# Altium schematic sheet Drive-It_schem.SchDoc
size 431 x 279 mm; SheetNumber: 1; SheetTotal: 1
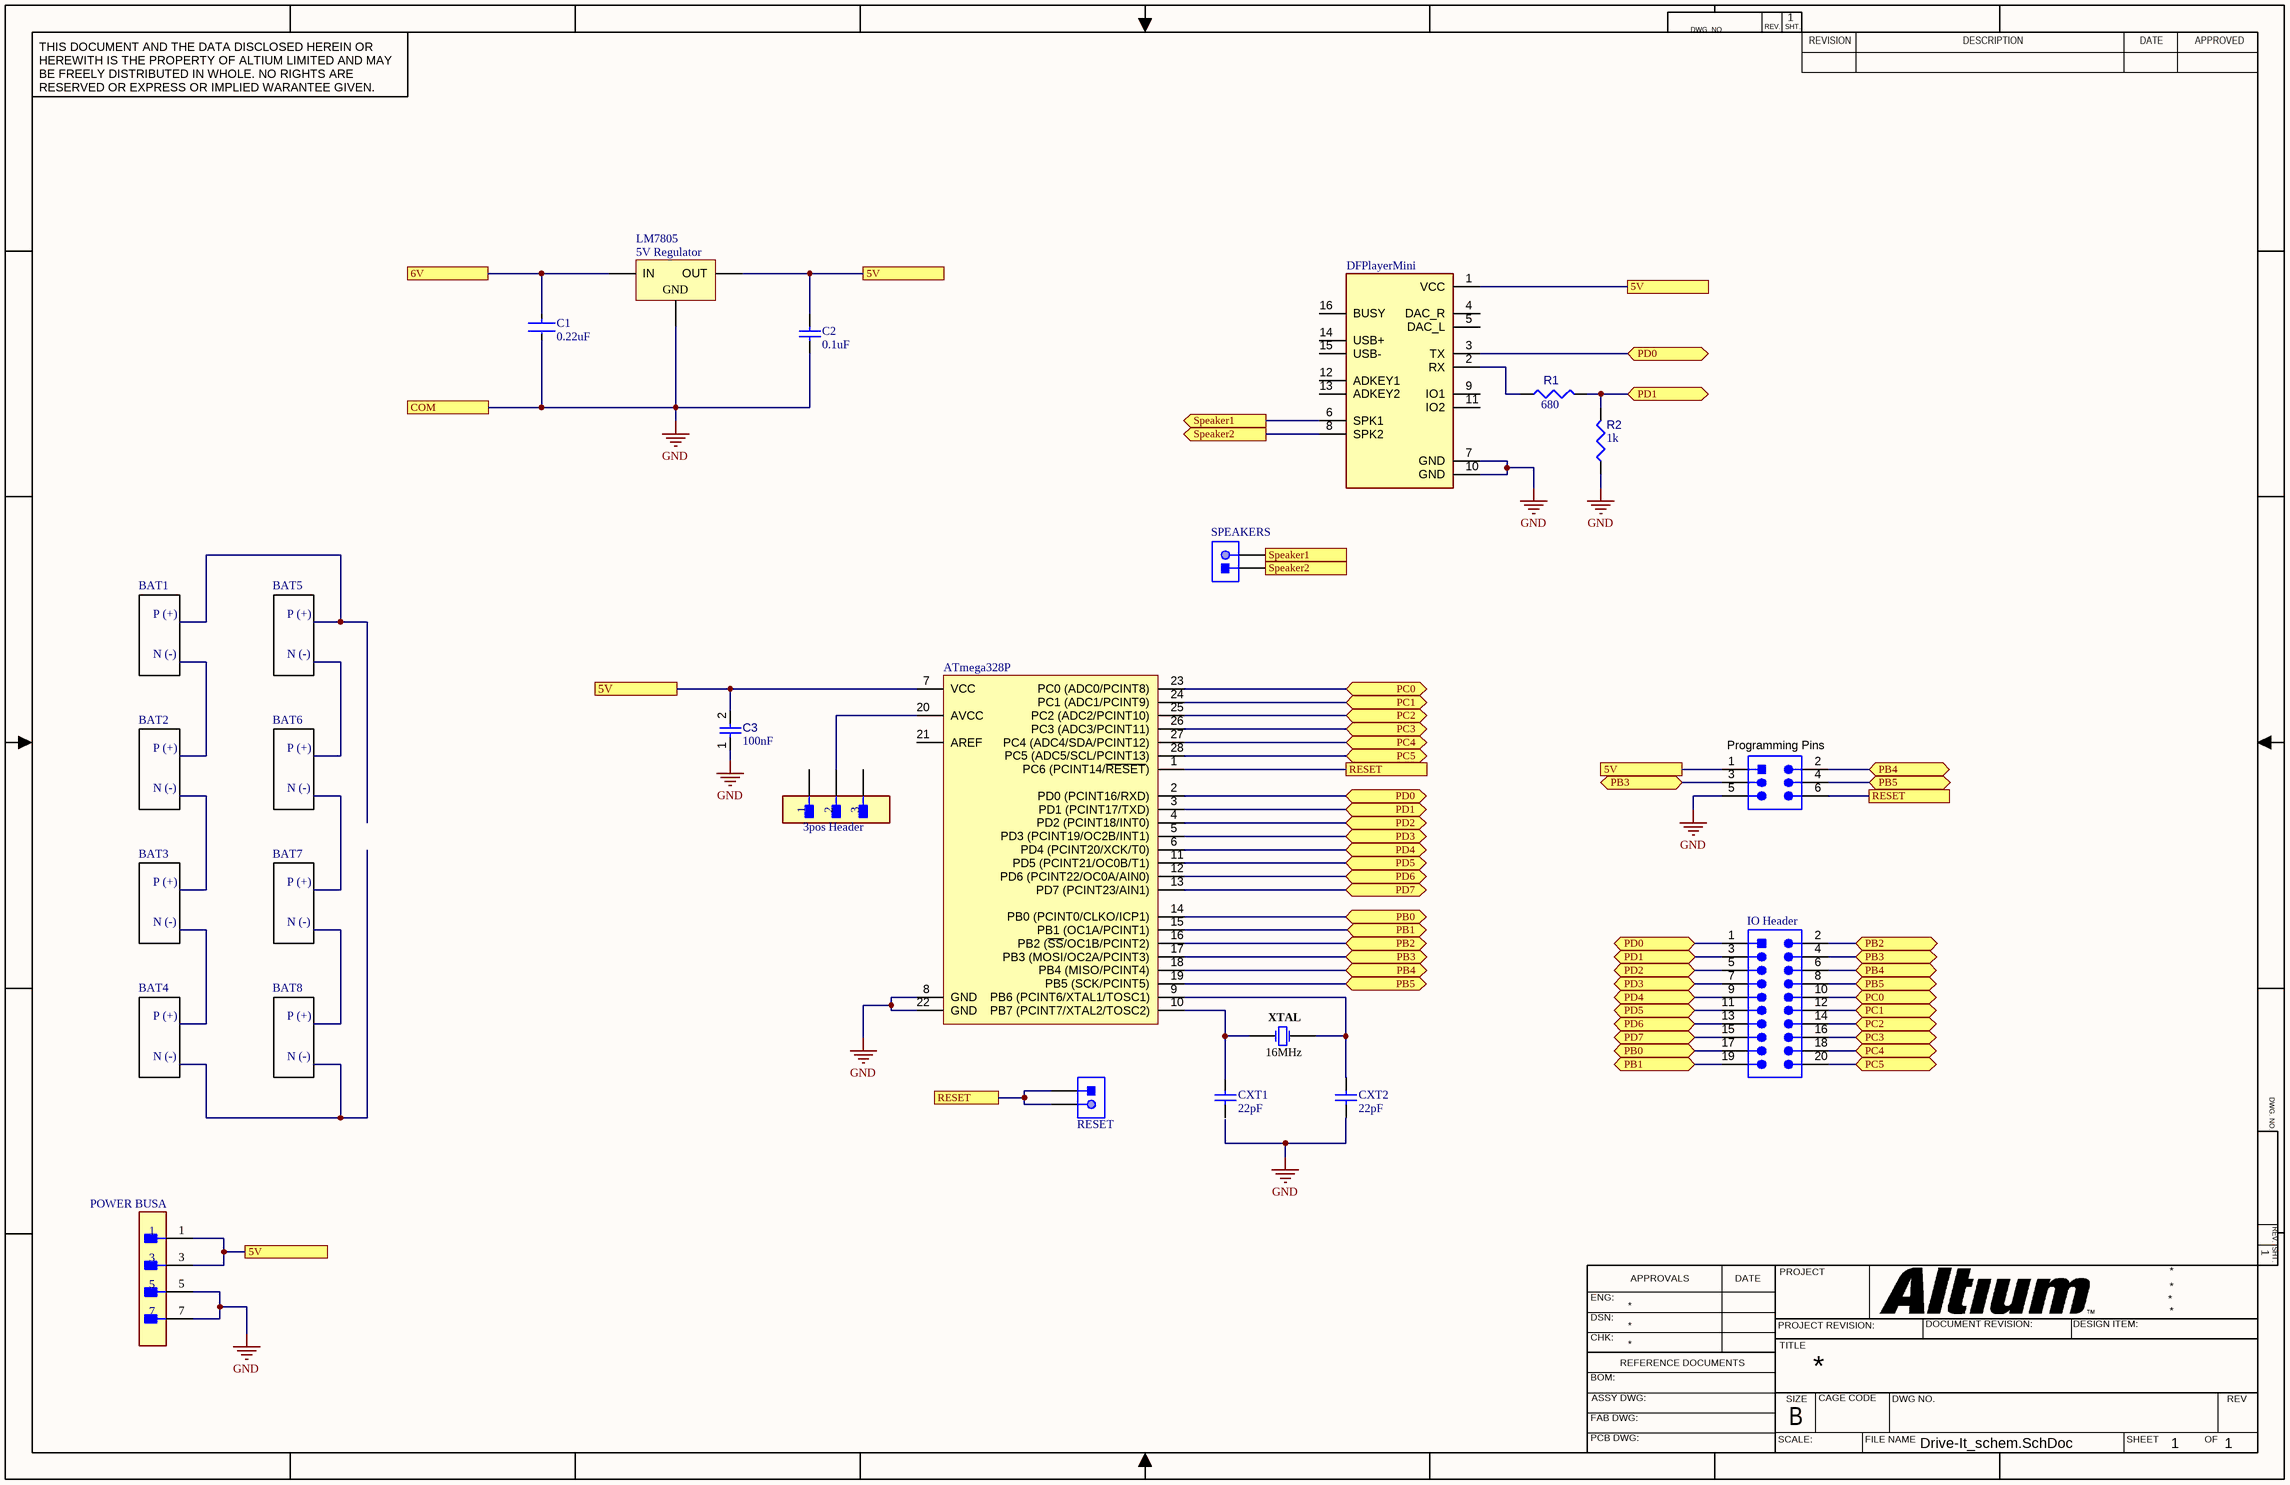
[diagram p0: Drive-It_schem.SchDoc]

## Parts
3pos_Header  (no value)  [FP-NRPN031PAEN-RC-MFG]
5V_Regulator  LM7805  [FAIR-TO-220-3]
ATmega328P  (no value)  [ATML-28P3]
BAT1  (no value)  [BAT_2222]
BAT2  (no value)  [BAT_2222]
BAT3  (no value)  [BAT_2222]
BAT4  (no value)  [BAT_2222]
BAT5  (no value)  [BAT_2222]
BAT6  (no value)  [BAT_2222]
BAT7  (no value)  [BAT_2222]
BAT8  (no value)  [BAT_2222]
C1  0.22uF  [FP-RCE1K1-2_5-MFG]
C2  0.1uF  [VISH-K104K15X7RF5TL2]
C3  value 100nF  [CAPR51-254-508X318X736]  (hidden comment: C320C104K5R5TA)
CXT1  22pF  [KEMT-C315-THT-2]
CXT2  22pF  [KEMT-C315-THT-2]
DFPlayerMini  (no value)  [MODULE_DFR0299]
IO_Header  (no value)  [SMTC-MW-10-03-G-D-245-065-P_V]
POWER_BUS  POWER BUS  [FP-M20-9980446-MFG]  (value not drawn)  (part A of 2)
Programming_Pins  (no value)  [SMTC-TSW-103-07-G-D_V]
R1  value 680  [RESA60-630X240]  (hidden comment: MFR-25FBF52-1K)
R2  value 1k  [RESA60-630X240]  (hidden comment: MFR-25FBF52-1K)
RESET  (no value)  [JST-B2P-VH(LF)(SN)_V]
SPEAKERS  (no value)  [JST-B2P-VH(LF)(SN)_V]
XTAL  16MHz  [JPY-49S-18PF]

## Ports
5V (see Drive-It_schem[3C], Drive-It_schem[3E], Drive-It_schem[5E], Drive-It_schem[6D]), 5V (see Drive-It_schem[3C], Drive-It_schem[3E], Drive-It_schem[5E], Drive-It_schem[8A]), 5V (see Drive-It_schem[3C], Drive-It_schem[3E], Drive-It_schem[6D], Drive-It_schem[8A]), 5V (see Drive-It_schem[3C], Drive-It_schem[5E], Drive-It_schem[6D], Drive-It_schem[8A]), 5V (see Drive-It_schem[3E], Drive-It_schem[5E], Drive-It_schem[6D], Drive-It_schem[8A]), 6V, COM, PB0 (bidir, see Drive-It_schem[3B]), PB0 (bidir, see Drive-It_schem[4C]), PB1 (bidir, see Drive-It_schem[3B]), PB1 (bidir, see Drive-It_schem[4C]), PB2 (bidir, see Drive-It_schem[2C]), PB2 (bidir, see Drive-It_schem[4C]), PB3 (bidir, see Drive-It_schem[2C], Drive-It_schem[3C]), PB3 (bidir, see Drive-It_schem[2C], Drive-It_schem[4C]), PB3 (bidir, see Drive-It_schem[3C], Drive-It_schem[4C]), PB4 (bidir, see Drive-It_schem[2C]), PB4 (bidir, see Drive-It_schem[2C], Drive-It_schem[4C]), PB5 (bidir, see Drive-It_schem[2C]), PB5 (bidir, see Drive-It_schem[2C], Drive-It_schem[4C]), PC0 (bidir, see Drive-It_schem[2B]), PC0 (bidir, see Drive-It_schem[4D]), PC1 (bidir, see Drive-It_schem[2B]), PC1 (bidir, see Drive-It_schem[4D]), PC2 (bidir, see Drive-It_schem[2B]), PC2 (bidir, see Drive-It_schem[4D]), PC3 (bidir, see Drive-It_schem[2B]), PC3 (bidir, see Drive-It_schem[4D]), PC4 (bidir, see Drive-It_schem[2B]), PC4 (bidir, see Drive-It_schem[4D]), PC5 (bidir, see Drive-It_schem[2B]), PC5 (bidir, see Drive-It_schem[4C]), PD0 (bidir, see Drive-It_schem[3C], Drive-It_schem[3E]), PD0 (bidir, see Drive-It_schem[3C], Drive-It_schem[4C]), PD0 (bidir, see Drive-It_schem[3E], Drive-It_schem[4C]), PD1 (bidir, see Drive-It_schem[3C], Drive-It_schem[3E]), PD1 (bidir, see Drive-It_schem[3C], Drive-It_schem[4C]), PD1 (bidir, see Drive-It_schem[3E], Drive-It_schem[4C]), PD2 (bidir, see Drive-It_schem[3C]), PD2 (bidir, see Drive-It_schem[4C]), PD3 (bidir, see Drive-It_schem[3C]), PD3 (bidir, see Drive-It_schem[4C]), PD4 (bidir, see Drive-It_schem[3B]), PD4 (bidir, see Drive-It_schem[4C]), PD5 (bidir, see Drive-It_schem[3B]), PD5 (bidir, see Drive-It_schem[4C]), PD6 (bidir, see Drive-It_schem[3B]), PD6 (bidir, see Drive-It_schem[4C]), PD7 (bidir, see Drive-It_schem[3B]), PD7 (bidir, see Drive-It_schem[4C]), RESET (see Drive-It_schem[2C], Drive-It_schem[4C]), RESET (see Drive-It_schem[2C], Drive-It_schem[5B]), RESET (see Drive-It_schem[4C], Drive-It_schem[5B]), Speaker1 (in, see Drive-It_schem[4E]), Speaker1 (out, see Drive-It_schem[4D]), Speaker2 (in, see Drive-It_schem[4E]), Speaker2 (out, see Drive-It_schem[4D])

## Nets
GND: 5V_Regulator.2(GND) ATmega328P.8(GND) ATmega328P.22(GND) C1.2 C2.1 C3.1 CXT2.1 DFPlayerMini.7(GND) DFPlayerMini.10(GND) POWER_BUS.5 POWER_BUS.7 Programming_Pins.5 R2.1 ; port COM
5V: 5V_Regulator.3(OUT) ATmega328P.7(VCC) C2.2 C3.2 DFPlayerMini.1(VCC) POWER_BUS.1 POWER_BUS.3 Programming_Pins.1 ; port 5V
6V: 5V_Regulator.1(IN) C1.1 ; port 6V
PB0: ATmega328P.14(PB0_(PCINT0/CLKO/ICP1)) IO_Header.17 ; port PB0
PB1: ATmega328P.15(PB1_(OC1A/PCINT1)) IO_Header.19 ; port PB1
PB2: ATmega328P.16(PB2_(~{SS}/OC1B/PCINT2)) IO_Header.2 ; port PB2
PB3: ATmega328P.17(PB3_(MOSI/OC2A/PCINT3)) IO_Header.4 Programming_Pins.3 ; port PB3
PB4: ATmega328P.18(PB4_(MISO/PCINT4)) IO_Header.6 Programming_Pins.2 ; port PB4
PB5: ATmega328P.19(PB5_(SCK/PCINT5)) IO_Header.8 Programming_Pins.4 ; port PB5
PC0: ATmega328P.23(PC0_(ADC0/PCINT8)) IO_Header.10 ; port PC0
PC1: ATmega328P.24(PC1_(ADC1/PCINT9)) IO_Header.12 ; port PC1
PC2: ATmega328P.25(PC2_(ADC2/PCINT10)) IO_Header.14 ; port PC2
PC3: ATmega328P.26(PC3_(ADC3/PCINT11)) IO_Header.16 ; port PC3
PC4: ATmega328P.27(PC4_(ADC4/SDA/PCINT12)) IO_Header.18 ; port PC4
PC5: ATmega328P.28(PC5_(ADC5/SCL/PCINT13)) IO_Header.20 ; port PC5
PD0: ATmega328P.2(PD0_(PCINT16/RXD)) DFPlayerMini.3(TX) IO_Header.1 ; port PD0
PD1: ATmega328P.3(PD1_(PCINT17/TXD)) IO_Header.3 R1.2 R2.2 ; port PD1
PD2: ATmega328P.4(PD2_(PCINT18/INT0)) IO_Header.5 ; port PD2
PD3: ATmega328P.5(PD3_(PCINT19/OC2B/INT1)) IO_Header.7 ; port PD3
PD4: ATmega328P.6(PD4_(PCINT20/XCK/T0)) IO_Header.9 ; port PD4
PD5: ATmega328P.11(PD5_(PCINT21/OC0B/T1)) IO_Header.11 ; port PD5
PD6: ATmega328P.12(PD6_(PCINT22/OC0A/AIN0)) IO_Header.13 ; port PD6
PD7: ATmega328P.13(PD7_(PCINT23/AIN1)) IO_Header.15 ; port PD7
RESET: ATmega328P.1(PC6_(PCINT14/~{RESET})) Programming_Pins.6 RESET.1 RESET.2 ; port RESET
Speaker1: DFPlayerMini.6(SPK1) SPEAKERS.2 ; port Speaker1
Speaker2: DFPlayerMini.8(SPK2) SPEAKERS.1 ; port Speaker2
Net3pos_Header_2: 3pos_Header.2 ATmega328P.20(AVCC)
NetATmega328P_9: ATmega328P.9(PB6_(PCINT6/XTAL1/TOSC1)) CXT2.2 XTAL.1
NetATmega328P_10: ATmega328P.10(PB7_(PCINT7/XTAL2/TOSC2)) CXT1.2 XTAL.2
NetBAT1_N: BAT1.N BAT2.P
NetBAT1_P: BAT1.P BAT5.P
NetBAT2_N: BAT2.N BAT3.P
NetBAT3_N: BAT3.N BAT4.P
NetBAT4_N: BAT4.N BAT8.N
NetBAT5_N: BAT5.N BAT6.P
NetBAT6_N: BAT6.N BAT7.P
NetBAT7_N: BAT7.N BAT8.P
NetDFPlayerMini_2: DFPlayerMini.2(RX) R1.1

Not connected (* = marked no-connect by the designer): 3pos_Header 1 3; ATmega328P 21(AREF); CXT1 1; DFPlayerMini 4(DAC_R) 5(DAC_L) 9(IO1) 11(IO2) 12(ADKEY1) 13(ADKEY2) 14(USB+) 15(USB-) 16(BUSY)

## Notes on the sheet
- DWG. NO.
- REV.
- SHT.
- THIS DOCUMENT AND THE DATA DISCLOSED HEREIN OR HEREWITH IS THE PROPERTY OF ALTIUM LIMITED AND MAY BE FREELY DISTRIBUTED IN WHOLE. NO RIGHTS ARE RESERVED OR EXPRESS OR IMPLIED WARANTEE GIVEN.
- REVISION
- DESCRIPTION
- DATE
- APPROVED
- ENG:
- APPROVALS
- PROJECT
- DSN:
- CHK:
- REFERENCE DOCUMENTS
- PROJECT REVISION:
- TITLE
- DOCUMENT REVISION:
- DESIGN ITEM:
- BOM:
- FAB DWG:
- PCB DWG:
- ASSY DWG:
- SCALE:
- SIZE
- B
- CAGE CODE
- FILE NAME
- DWG NO.
- SHEET
- OF
- REV
- (in symbol CMP-018-000001-4) P (+); N (-)

## Library data of the parts
3pos_Header = CMP-25680-000021-1: CONN HEADER VERT 3POS 2MM; Manufacturer Part Number: NRPN031PAEN-RC; Manufacturer: Sullins; Number Of Contacts: 3; Conn Orientation: Straight; Voltage Rating: 150V; Conn Gender: Male; Current Rating: 2A; Temperature Range High: +105°C; Category: Conn; RoHS: TRUE; Contact Material: Gold,Nickel; ComponentLink2URL: https://drawings-pdf.s3.amazonaws.com/10531.pdf; Temperature: -40°C to +105°C; Lead Free: Yes; Octopart: https://octopart.com/nrpn031paen-rc-sullins-12817732; ComponentLink2Description: Datasheet; Pitch: 2mm; Number Of Rows: 1; Automotive: No; Height: 6mm; Device Class L2: Headers and Wire Housings; Digikey Description: CONN HEADER VERT 3POS 2MM; Package: 0; Device Class L3: unset; Temperature Range Low: -40°C; Device Class L1: Connectors
5V_Regulator = CMP-2000-04938-1: Positive Voltage Regulator, 5 V, 1 A, -40 to 125 degC, 3-Pin TO-220, RoHS, Tube; Manufacturer: FairchildSemiconductor; Maximum Input Voltage: 35V; Maximum Quiescent Current: 8mA; Load Regulation: 100mV; Maximum Output Current: 2.2(Typ)A; Output Type: Fixed; Typical Dropout Voltage @ Current: 2@1AV; Rad Hard: No; Output Voltage: 5V; Accuracy: ±4%; Number of Outputs: 1; Category: LinearRegulator; Package Description: 3-Pin Through Hole Device, Body 10 x 4.5 mm, Pitch 2.54 mm; Packaging: Rail/Tube; Mounting: ThroughHole; Polarity: Positive; Manufacturer URL: https://www.fairchildsemi.com/; Line Regulation: 100mV; Datasheet Version: Aug-12; Datasheet URL: https://datasheet.ciiva.com/26904/lm7805ct-26904988.pdf; Package Reference: TO-220; Package URL: https://www.fairchildsemi.com/package-drawings/TO/TO220B03.pdf; Package: 3TO-220AB; Operating Temperature: -40to125degC; Type: Linear
ATmega328P = CMP-020-00004-3: 8-Bit Microcontroller with 32 KBytes In-System Programmable Flash, 23 I/Os, -40 to 85 degC, 28-Pin PDIP (28P3), RoHS, Tube; Manufacturer: Atmel; I/Os: 23; Density: 32KB; Package Version: Rev. B, 09/2001; Max Clock Frequency: 20MHz; Interface: USART; Max Supply Voltage: 5.5V; Min Supply Voltage: 1.8V; Ethernet Channels: 0; RAM Size: 2KB; RoHS Compliant: True; Datasheet URL: http://www.atmel.com/images/Atmel-8271-8-bit-AVR-Microcontroller-ATmega48A-48PA-88A-88PA-168A-168PA-328-328P_datasheet_Complete.pdf; Packaging: Rail/Tube; Manufacturer URL: http://www.atmel.com/; Mounting Technology: TH; Package URL: http://www.atmel.com/images/Atmel-8271-8-bit-AVR-Microcontroller-ATmega48A-48PA-88A-88PA-168A-168PA-328-328P_datasheet_Complete.pdf; Datasheet Version: Rev. 8271J, 11/2015; Package Description: 28-Pin Plastic Dual Inline Package, Body 34.671 x 7.3025 mm, Pitch 2.54 mm; Package Quantity: 14; Min Operating Temperature: -40°C; Max Operating Temperature: 85°C; Case/Package: DIP; Pins: 28; Package Reference: 28P3
BAT1-BAT8 = CMP-018-000001-4: Keystone Electronics single AA battery connector; Connector Type: PC Pin; Package: None; Value: *; Price: None; Availability: Unavailable; Mounting Technology: through-hole; Pin Count: 2; Source: 2222.SchLib; MP: 2222; Component Type: Standard; Design Item ID: 2222
C1 = CMP-06035-033138-1: Cap Ceramic Monolithic 220nF 50V 10% Thru-Hole Bulk; Lead Diameter: 0.5mm; Lead/Base Style: Formed Leads; Dielectric: X7R; Ratings: AEC-Q200; Min Operating Temperature: -55°C; Resistor Type: Ceramic; Height - Seated (Max): 0.138inch; Voltage Rating (DC): 50V; Termination: Radial; Max Operating Temperature: 125°C; Tolerance: 10%; Lead Pitch: 0.197inch; Case/Package: Radial; Capacitance: 220nF; Mount: Through Hole; Height: 3.5mm; Packaging: Bulk; Voltage Rating: 50V; Length: 0.157inch; Width: 0.098inch; Package Quantity: 500
C2 = CMP-2000-06508-1: Ceramic Capacitor, 100 nF, +/- 10%, 50 V, -55 to 125 degC, 2-Pin THD, RoHS, Tape and Reel; Manufacturer: Vishay; Other Names: BC1084CT; Catalog Drawings: Mono-KapSide2-15_5.58Mono-KapSide1_15; Temperature Coefficient: X7R; Voltage - Rated: 50V; Online Catalog: Mono-Kap™Series; Capacitance: 0.1µF; Size / Dimension: 0.157"Lx0.098"W(4.00mmx2.50mm); Operating Temperature: -55°C~125°C; Family: CeramicCapacitors; Manufacturer URL: http://www.vishay.com/; Standard Package: 1; Thickness (Max): -; Ratings: -; Datasheet Version: 08/2013; Package Description: 2-Pin Through Hole Device, Body 4 x 2.6 mm; Mounting Type: ThroughHole; Features: -; Lead Spacing: 0.098"(2.50mm); Tolerance: ±10%; Category: Capacitors; Mounting Technology: ThroughHole; Lead Style: Straight; Datasheet URL: http://www.vishay.com/docs/45171/kseries.pdf; Applications: GeneralPurpose; Package / Case: Radial; Height - Seated (Max): 0.220"(5.58mm); Package Reference: K104K15X7RF5TL2; Series: Mono-Kap™K; Packaging: CutTape(CT)
C3 = CMP-001-00088-1: Ceramic Capacitor, Multilayer, Ceramic, 50V, 10% +Tol, 10% -Tol, X7R, 15% TC, 0.1uF, Through Hole Mount; Mounting Technology: Through Hole; Voltage Rating: 50V; RoHS Compliant: Yes; Min Operating Temperature: -55°C; Max Operating Temperature: 125°C; Pins: 2; Tolerance: 10%; Capacitor Type: Ceramic
CXT1 CXT2 = CMP-1664-00008-1: Capacitor, Ceramic, 22 pF, +/-10 %, 100 V, -55 to 125 degC, 2-Pin THD, RoHS, Bulk; Max Input Voltage: 40 V; Min Input Voltage: 4.2 V; Output Current: 1.5 A; Output Voltage: 1.2 V; Outputs: 1; Case\Package: TO-220; RoHSCompliant: true; Min Operating Temperature: 0 degC; Max Operating Temperature: 125 degC; Package Quantity: 50; ComponentLink2URL: http://capacitoredge.kemet.com/capedge2/DataSheet/Datasheet-C315C220K1G5TA.pdf?pn=C315C220K1G5TA{BULK}; Radiation Hardening: No; Pins: 3; Length: 10.28 mm; ComponentLink1URL: http://www.kemet.com/; ComponentLink2Description: Datasheet; Height: 9.28 mm; REACH SVHC: No SVHC; ComponentLink1Description: Manufacturer URL; Max Ouput Current: 1.5 A; Weight: 0.08113 oz; Packaging: Rail/Tube; DatasheetVersion: Aug-16; Mount: Through Hole; PackageReference: C315-THT-2; Width: 4.82 mm; PackageDescription: 2-Pin Through Hole Device, Body 3.81 x 2.54 mm
DFPlayerMini = DFR0299: Dfplayer - a Mini Mp3 Player; Package: None; Price: None; Value: *; MP: DFR0299; Availability: Unavailable
IO_Header = CMP-002-00046-2: Flexible Micro Board Stacker, Pitch 1 mm, 2 x 10 Position, Height 9.4 mm, -55 to 125 degC, RoHS, Tape and Reel; Manufacturer: Samtec; Connector Type: Header; Gender: Male; Min Operating Temperature: -55°C; Pins: 20; Datasheet URL: http://suddendocs.samtec.com/prints/mw-xx-03-x-d-xxx-xxx-xx-mkt.pdf; Package Reference: MW-10-03-G-D-245-065-P; Case/Package: MW-10-03-G-D-245-065-P; Package Description: Flexible Micro Board Stacker, Pitch 1 mm, 2 x 10 Position, Height 9.4 mm; Packaging: TapeandReel; Max Operating Temperature: 125°C; RoHS Compliant: True; Datasheet Version: 34759; Manufacturer URL: https://www.samtec.com/; Mounting Technology: SM
POWER_BUS = CMP-15831-000088-1: CONN HEADER VERT 8POS 2.54MM; Row Spacing: 0.1inch; Current Rating: 3A; Mated Stacking Heights: 16.54mm; Insulation Resistance: 10GR; Connector Type: Male Pin; Gender: Male; Number of Contacts: 8; Contact Resistance: 30mR; Contact Material: Brass; Series: M20; Max Operating Temperature: 105°C; REACH SVHC: No SVHC; Flammability Rating: UL94 V-0; Number of Rows: 2; Mount: Through Hole; Contact Plating: Tin; Min Operating Temperature: -40°C; Packaging: Bulk; Radiation Hardening: No; Insulation Material: Nylon; Orientation: Straight; Contact Shape: Square; Max Current Rating: 3A; Contact Type: Male Pin; Depth: 5.08mm; Color: Black; Contact Finish - Mating: TIN; Length: 10.16mm; Housing Color: Black; Package Quantity: 1000; Pitch: 2.54mm; Contact Mating Length: 0.24inch; Termination: Solder; Housing Material: Nylon; Fastening Type: Pull; Insulation Color: Black; Number of Positions: 8; RoHS Compliant: Yes
Programming_Pins = CMP-2000-07329-1: Through Hole Header, Pitch 2.54 mm, 2 x 3 Position, Height 8.58 mm, Tail Length 2.54 mm, -55 to 125 degC, RoHS, Bulk; Manufacturer: Samtec-Inc.; Number of Positions Loaded: All; Number of Positions: 6; Row Spacing: 0.100"(2.54mm); Connector Type: Header,Unshrouded; Package Reference: TSW-103-07-G-D; Termination: Solder; Manufacturer URL: http://www.samtec.com/; Contact Finish: Gold; Contact Mating Length: 0.230"(5.84mm); Package Description: Through Hole Header, Pitch 2.54 mm, 2 x 3 Position, Height 8.58 mm, Tail Length 2.54 mm; Datasheet Version: 12/2015; Number of Rows: 2; Features: -; Family: RectangularConnectors-Headers,MalePins; Fastening Type: -; Datasheet URL: http://suddendocs.samtec.com/catalog_english/tsw_th.pdf; Category: Connectors,Interconnects; Package URL: http://suddendocs.samtec.com/prints/tsw-xxx-xx-xxx-x-xx-xxx-mkt.pdf; Mounting Type: ThroughHole; Contact Finish Thickness: 10µin(0.25µm); Packaging: Bulk; Color: Black; Pitch: 0.100"(2.54mm); Series: TSW; Contact Type: MalePin; Mounting Technology: ThroughHole
R1 R2 = CMP-009-00048-4: Axial Resistor, 1 KOhm, +/- 1%, 250 mW, -55 to 155 degC, 2-Pin THD, RoHS, Bulk; Manufacturer: Yageo; Voltage Rating: 250V; Power: 250mW; Min Operating Temperature: -55°C; Max Operating Temperature: 155°C; Tolerance: 1%; Package Reference: MFR-25; Composition: CarbonFilm; Mounting Technology: TH; Packaging: Bulk; Case/Package: Axial; Datasheet URL: http://www.yageo.com/documents/recent/Yageo%20LR_MFR_2013.pdf; Package Quantity: 200; Manufacturer URL: http://www.yageo.com/; Package Description: 2-Pin Axial Lead, Dia 2.4 mm, Body Length 6.3 mm; Datasheet Version: Apr-13; RoHS Compliant: True
RESET SPEAKERS = CMP-002-00025-2: Male Header, Pitch 3.96 mm, 1 x 2 Position, Height 10.9 mm, Tail Length 3.7 mm, -25 to 85 degC, RoHS, Bulk; Manufacturer: JST; Case/Package: B2P-VH(LF)(SN); Connector Type: Header; Mounting Technology: TH; Package Reference: B2P-VH(LF)(SN); Package Description: Male Header, Pitch 3.96 mm, 1 x 2 Position, Height 10.9 mm, Tail Length 3.7 mm; Max Operating Temperature: 85°C; Manufacturer URL: http://www.jst.com/home2.html; RoHS Compliant: Unknown; Datasheet Version: May-16; Gender: Male; Min Operating Temperature: -25°C; Datasheet URL: http://www.jst-mfg.com/product/pdf/eng/eVH.pdf
XTAL = CMP-003-00000-2: Crystal, 16 MHz, +/-20 ppm, 18 pF, -20 to 70 degC, 2-Pin THD, RoHS; Manufacturer: Shenzhen Jingpengyuan; Package Description: 2-Pin Through Hole Device, Body 11.05 x 4.65 mm, Pitch 4.88 mm; Mounting Technology: TH; Datasheet Version: Aug-14; Frequency: 16MHz; Package Reference: 49S-18PF; RoHS Compliant: Unknown; Datasheet URL: http://datasheet.octopart.com/49S-18PF-Xinhunjing-datasheet-30677139.pdf; Case/Package: 49S-18PF; Manufacturer URL: http://www.chjiahui.com/